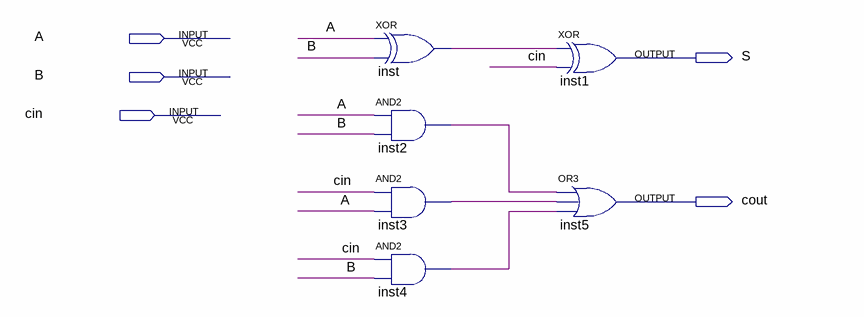
[diagram p0: schematic sheet]
// Quartus schematic rjr_fulladder.bdf as structural Verilog: 6 symbols, 5 pins
module rjr_fulladder (
  input  A,
  input  B,
  input  cin,
  output S,
  output cout
);

  wire inst2_out, inst3_out, inst4_out, inst_out;

  xor inst (inst_out, A, B);
  and inst2 (inst2_out, A, B);
  and inst3 (inst3_out, cin, A);
  and inst4 (inst4_out, cin, B);
  xor inst1 (S, inst_out, cin);
  or inst5 (cout, inst2_out, inst3_out, inst4_out);
endmodule
